# EAGLE design schematic (EAGLE 9.6.1)
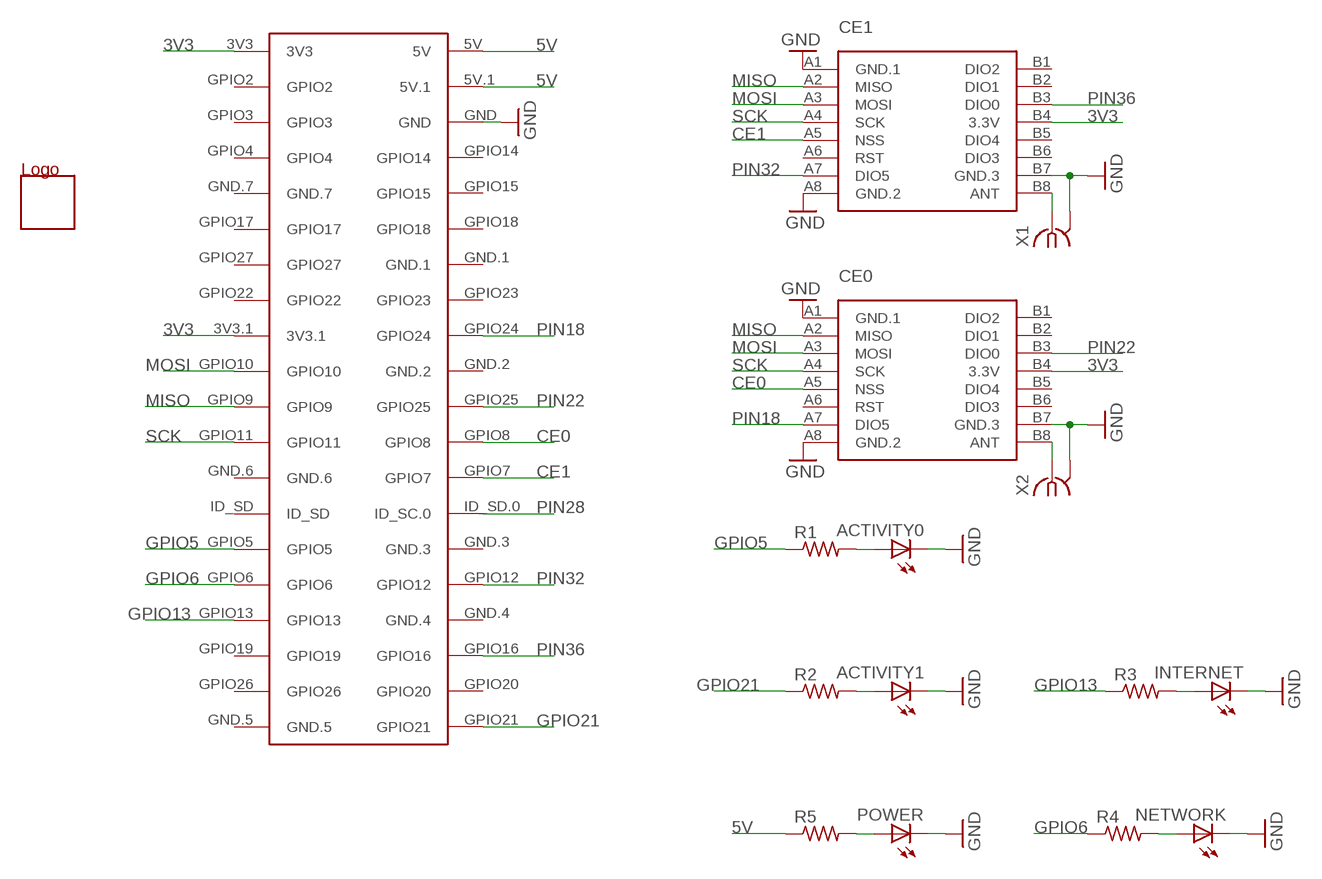
[diagram p0: schematic, sheet 1]

## Parts
ACTIVITY0  LEDCHIPLED_0805  [CHIPLED_0805]
ACTIVITY1  LEDCHIPLED_0805  [CHIPLED_0805]
CE0  WIRELESS-LORA-RFM95W#SMD  [WIRELESS-LORA-RFM95W#SMD]
CE1  WIRELESS-LORA-RFM95W#SMD  [WIRELESS-LORA-RFM95W#SMD]
INTERNET  LEDCHIPLED_0805  [CHIPLED_0805]
NETWORK  LEDCHIPLED_0805  [CHIPLED_0805]
POWER  LEDCHIPLED_0805  [CHIPLED_0805]
R1  R-US_R0805  [R0805]
R2  R-US_R0805  [R0805]
R3  R-US_R0805  [R0805]
R4  R-US_R0805  [R0805]
R5  R-US_R0805  [R0805]
U$1  PIZERO  [PIZERO]
U$2  REGANLOGO  [REGANLOGO]
X1  BU-SMA-V  [BU-SMA-V]
X2  BU-SMA-V  [BU-SMA-V]

## Nets
3V3: CE0.B4(3.3V) CE1.B4(3.3V) U$1.3V3 U$1.3V3.1
5V: R5.1 U$1.5V U$1.5V.1
CE0: CE0.A5(NSS) U$1.GPIO8
CE1: CE1.A5(NSS) U$1.GPIO7
GND: ACTIVITY0.C ACTIVITY1.C CE0.A1(GND.1) CE0.A8(GND.2) CE0.B7(GND.3) CE1.A1(GND.1) CE1.A8(GND.2) CE1.B7(GND.3) INTERNET.C NETWORK.C POWER.C U$1.GND X1.2 X1.3 X1.4 X1.5 X2.2 X2.3 X2.4 X2.5
GPIO5: R1.1 U$1.GPIO5
GPIO6: R4.1 U$1.GPIO6
GPIO13: R3.1 U$1.GPIO13
GPIO21: R2.1 U$1.GPIO21
MISO: CE0.A2(MISO) CE1.A2(MISO) U$1.GPIO9
MOSI: CE0.A3(MOSI) CE1.A3(MOSI) U$1.GPIO10
N$1: ACTIVITY0.A R1.2
N$2: ACTIVITY1.A R2.2
N$3: INTERNET.A R3.2
N$4: NETWORK.A R4.2
N$5: POWER.A R5.2
N$6: CE1.B8(ANT) X1.1
N$7: CE0.B8(ANT) X2.1
PIN18: CE0.A7(DIO5) U$1.GPIO24
PIN22: CE0.B3(DIO0) U$1.GPIO25
PIN28: U$1.ID_SD.0(ID_SC.0)
PIN32: CE1.A7(DIO5) U$1.GPIO12
PIN36: CE1.B3(DIO0) U$1.GPIO16
SCK: CE0.A4(SCK) CE1.A4(SCK) U$1.GPIO11
Unconnected: CE0.A6(RST) CE0.B1(DIO2) CE0.B2(DIO1) CE0.B5(DIO4) CE0.B6(DIO3) CE1.A6(RST) CE1.B1(DIO2) CE1.B2(DIO1) CE1.B5(DIO4) CE1.B6(DIO3) U$1.GND.1 U$1.GND.2 U$1.GND.3 U$1.GND.4 U$1.GND.5 U$1.GND.6 U$1.GND.7 U$1.GPIO2 U$1.GPIO3 U$1.GPIO4 U$1.GPIO14 U$1.GPIO15 U$1.GPIO17 U$1.GPIO18 U$1.GPIO19 U$1.GPIO20 U$1.GPIO22 U$1.GPIO23 U$1.GPIO26 U$1.GPIO27 U$1.ID_SD

## Library data of the parts
ACTIVITY0 ACTIVITY1 INTERNET NETWORK POWER = adafruit:LED: LED OSRAM: - CHIPLED LG R971, LG N971, LY N971, LG Q971, LY Q971, LO R971, LY R971 LH N974, LH R974 LS Q976, LO Q976, LY Q976 LO Q996 - Hyper CHIPLED LW Q18S LB Q993, LB Q99A, LB R99A - SideLED LS A670, LO A670, LY A670, LG A670, LP A670 LB A673, LV A673, LT A673, LW A673 LH A674 LY A675 LS A676, LA A676, LO A676, LY A676, LW A676 LS A679, LY A679, LG A679 - Hyper Micro SIDELED® LS Y876, LA Y876, LO Y876, LY Y876 LT Y87S - SmartLED LW L88C, LW L88S LB L89C, LB L89S, LG L890 LS L89K, LO L89K, LY L89K LS L896, LA L896, LO L896, LY L896 - TOPLED LS T670, LO T670, LY T670, LG T670, LP T670 LSG T670, LSP T670, LSY T670, LOP T670, LYG T670 LG T671, LOG T671, LSG T671 LB T673, LV T673, LT T673, LW T673 LH T674 LS T676, LA T676, LO T676, LY T676, LB T676, LH T676, LSB T676, LW T676 LB T67C, LV T67C, LT T67C, LS T67K, LO T67K, LY T67K, LW E67C LS E67B, LA E67B, LO E67B, LY E67B, LB E67C, LV E67C, LT E67C LW T67C LS T679, LY T679, LG T679 LS T770, LO T770, LY T770, LG T770, LP T770 LB T773, LV T773, LT T773, LW T773 LH T774 LS E675, LA E675, LY E675, LS T675 LS T776, LA T776, LO T776, LY T776, LB T776 LHGB T686 LT T68C, LB T68C - Hyper Mini TOPLED® LB M676 - Mini TOPLED Santana® LG M470 LS M47K, LO M47K, LY M47K Source: http://www.osram.convergy.de/
CE0 CE1 = diy-modules:WIRELESS-LORA-RFM95W: 868/915 MHz LoRa Radio Transceiver Module based on SX1276 chip Click here to find device on ebay.com <http://www.ebay.com/sch/RFM95W+transceiver>
R1-R5 = rcl:R-US_: RESISTOR, American symbol; SPICEPREFIX: R
U$1 = MyLib:PIZERO
U$2 = MyLib:REGANLOGO
X1 X2 = con-coax:BU-SMA-V: FEMALE SMA CONNECTOR Radiall distributor RS 112-3794; OC_FARNELL: unknown; OC_NEWARK: unknown

## Board
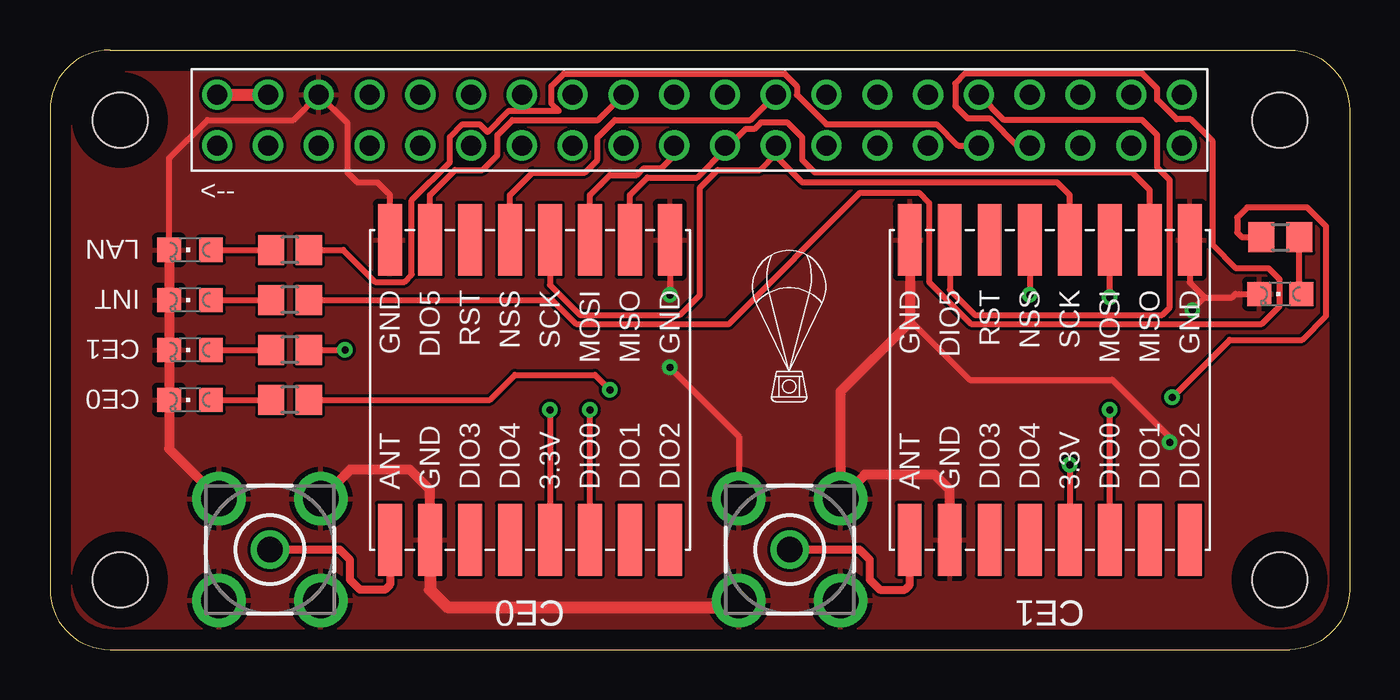
[diagram p1: board, top side]
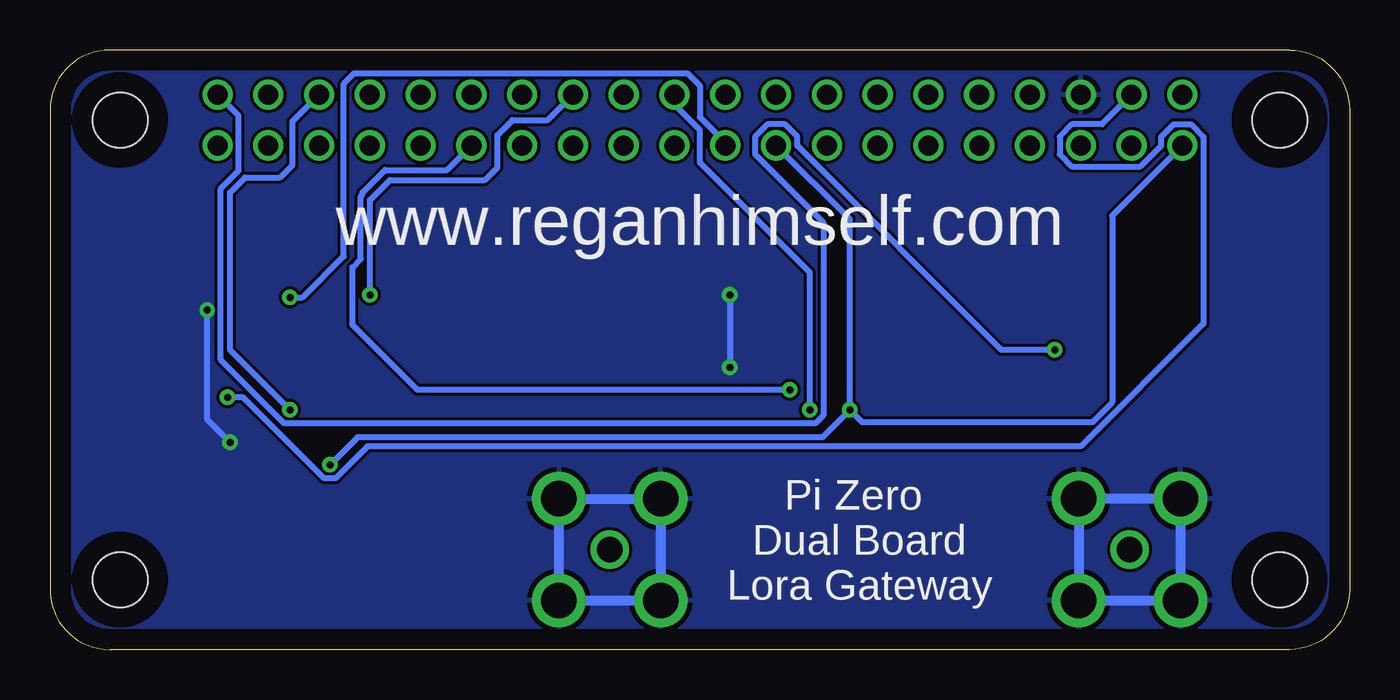
[diagram p2: board, bottom side, seen from below]

Size 65 x 30 mm. Coordinates in mm from the lower left corner, seen from the top.
Outline: 3,30 62,30 arc-90 65,27 65,3 arc-90 62,0 3,0 arc-90 0,3 0,27 arc-90 3,30
Copper layers (1*16): Top 0.035mm / dielectric 1.5mm / Bottom 0.035mm
Design rules "default": minimum track width 6mil, minimum drill 0.35mm, track to track 6mil, track to pad 6mil, pad to pad 6mil, via to via 6mil, smd to smd 6mil, copper to edge 40mil, drill to drill 6mil, minimum pad ring 10mil, minimum via ring 8mil, stop-mask expansion 4mil, vias tented up to drill 0mil, thermal gap 10mil
Holes 2.75 mm at 3.5,26.5 61.5,26.5 61.5,3.5 3.5,3.5

### Footprints (pad centres in the part's own frame; a part is rotated, then mirrored left to right if it is on the bottom)
CHIPLED_0805 = smd 1.2 x 1.2: A 0,-1.05; C 0,1.05
WIRELESS-LORA-RFM95W#SMD = smd 3.6 x 1.2: A1 -7.5,7; A2 -7.5,5; A3 -7.5,3; A4 -7.5,1; A5 -7.5,-1; A6 -7.5,-3; A7 -7.5,-5; A8 -7.5,-7; B1 7.5,7; B2 7.5,5; B3 7.5,3; B4 7.5,1; B5 7.5,-1; B6 7.5,-3; B7 7.5,-5; B8 7.5,-7
R0805 = smd 1.3 x 1.5: 1 -0.95,0; 2 0.95,0
PIZERO = drill 1: 3V3 0,0; 3V3.1 0,-20.32; 5V 2.54,0; 5V.1 2.54,-2.54; GND 2.54,-5.08; GND.1 2.54,-15.24; GND.2 2.54,-22.86; GND.3 2.54,-35.56; GND.4 2.54,-40.64; GND.5 0,-48.26; GND.6 0,-30.48; GND.7 0,-10.16; GPIO2 0,-2.54; GPIO3 0,-5.08; GPIO4 0,-7.62; GPIO5 0,-35.56; GPIO6 0,-38.1; GPIO7 2.54,-30.48; GPIO8 2.54,-27.94; GPIO9 0,-25.4; GPIO10 0,-22.86; GPIO11 0,-27.94; GPIO12 2.54,-38.1; GPIO13 0,-40.64; GPIO14 2.54,-7.62; GPIO15 2.54,-10.16; GPIO16 2.54,-43.18; GPIO17 0,-12.7; GPIO18 2.54,-12.7; GPIO19 0,-43.18; GPIO20 2.54,-45.72; GPIO21 2.54,-48.26; GPIO22 0,-17.78; GPIO23 2.54,-17.78; GPIO24 2.54,-20.32; GPIO25 2.54,-25.4; GPIO26 0,-45.72; GPIO27 0,-15.24; ID_SD 0,-33.02; ID_SD.0 2.54,-33.02
BU-SMA-V = drill 1.27: 1 0,0 | drill 1.778: 2 -2.55,2.55; 3 2.55,2.55; 4 2.55,-2.55; 5 -2.55,-2.55

### Placement (x,y rotation side)
ACTIVITY0  7,12.5 90 top
ACTIVITY1  7,15 90 top
CE0  24,13 270 top
CE1  50,13 270 top
INTERNET  7,17.5 90 top
NETWORK  7,20 90 top
POWER  61.53,17.79 90 top
R1  12,12.5 180 top
R2  12,15 180 top
R3  12,17.5 180 top
R4  12,20 180 top
R5  61.54,20.63 0 top
U$1  8.36,25.22 90 top
U$2  30.88,3.12 0 top
X1  37,5 0 top
X2  11,5 90 top

### Tracks (layer width: path | path; a pad name or v marks a point on that pad's centre or on a via)
3V3  (via drill 0.35)
  Top 0.3: v25,12 CE0.B4 | v51,9.25 CE1.B4
  Bottom 0.3: v25,12 25,21.54 U$1.3V3.1 | v25,12 26.38,10.62 49.62,10.62 v51,9.25 | U$1.3V3 11.88,21.71 11.88,12.38 12.88,11.38 24.38,11.38 v25,12
5V  (via drill 0.35)
  Top 0.3: v56.12,12.62 59,15.5 62.62,15.5 63.83,16.7 63.83,21.17 62.88,22.12 59.88,22.12 59.38,21.62 59.38,20.88 59.62,20.63 R5.1
  Top 0.6: U$1.5V U$1.5V.1
  Bottom 0.3: U$1.5V.1 12.38,26.28 13.88,26.28 14.5,25.66 14.5,24.78 13.88,24.17 10.46,24.17 9.42,25.21 9.42,25.66 8.8,26.28 7.92,26.28 7.3,25.66 7.3,16.31 13.44,10.17 49.11,10.17 50.72,8.57 51.28,8.57 55.34,12.62 v56.12,12.62
CE0
  Top 0.3: CE0.A5 23,22.75 24.12,23.88 26.75,23.88 27.38,24.5 27.38,25.62 28.25,26.5 35.04,26.5 U$1.GPIO8
CE1  (via drill 0.35)
  Top 0.3: CE1.A5 v49,17.75
  Bottom 0.3: v49,17.75 49,22.5 48,23.5 43.25,23.5 42.62,24.12 42.62,25.75 41.88,26.5 40.1,26.5 U$1.GPIO7
GND  (via drill 0.35)
  Top 0.3: CE1.A1 57,18.38 57.75,17.62 | POWER.C 59.29,17.79 59.12,17.62 57.75,17.62 | CE0.A8 17,22.75 16.38,23.38 15.38,23.38 14.88,23.88 14.88,26.33 U$1.GND 12.18,26.5 7.88,26.5 5.95,24.58 NETWORK.C | CE0.A1 v31,17.75 | v31,14.12 34.45,10.67 X1.2 | 43,16.38 43.12,16.38 46,13.5 53.12,13.5 56,10.62 v56,10.38 | v57.13,16.98 57.13,17.01 57.75,17.62
  Top 0.5: NETWORK.C INTERNET.C ACTIVITY1.C ACTIVITY0.C 5.95,10.05 X2.3 | CE0.B7 19,8 18,9 15,9 X2.4 | CE1.B7 45,8 44.25,8.75 40.75,8.75 X1.3 39.55,12.92 43,16.38 CE1.A8
  Top 0.6: CE0.B7 19,3 19.88,2.12 34.12,2.12 X1.5
  Bottom 0.3: v31,17.75 v31,14.12 | v56,10.38 57.13,11.51 v57.13,16.98
  Bottom 0.5: X2.3 X2.4 X2.5 X2.2 X2.3 | X1.2 X1.5 X1.4 X1.3 X1.2
  pour Top: 61.88,17 60.88,16 60,16 59.12,16 59,15.88 59.12,15.75 61.88,15.75 62.38,15.75 63.5,16.88 63.5,17
  pour Top: 33.62,23.75 32.75,22.88 32.75,17.62 31.75,16.62 33.75,16.62 40.12,23 37.62,23 36.88,23.75
  pour Top: -4,31.5 -4,-3.5 68.5,-3.5 68.5,32 -4,32
  pour Bottom: -4,33.5 -4,-3.5 68.5,-3.5 68.5,32 68.5,33.5
GPIO5  (via drill 0.35)
  Top 0.3: R1.1 22,12.5 23.25,13.75 27.25,13.75 v28,13
  Bottom 0.3: v28,13 46.62,13 49.88,16.25 49.88,19.12 49.45,19.55 49.45,22.69 49.38,22.77 49.38,22.88 48.25,24 45.14,24 U$1.GPIO5
GPIO6
  Top 0.3: R4.1 14.67,20 16.27,18.4 17.73,18.4 18.1,18.77 18.1,22.49 20.01,24.39 20.01,25.66 20.62,26.28 21.5,26.28 21.88,25.9 22.94,26.95 25.46,26.95 25.09,27.32 25.09,28.2 25.7,28.82 36.74,28.82 37.36,28.2 37.36,27.75 38.83,26.28 44.36,26.28 45.42,25.22 U$1.GPIO6
GPIO13
  Top 0.3: R3.1 25.11,17.5 26.31,16.3 33.97,16.3 40.52,22.85 43.47,22.85 43.97,22.35 43.97,18.39 46.06,16.3 60.61,16.3 61.51,17.19 61.51,18.52 60.95,19.07 59.33,19.07 58.15,20.24 58.15,25.44 57.06,26.53 56.36,26.53 55.39,27.5 55.39,28.08 54.64,28.82 45.77,28.82 45.28,28.33 45.28,27.2 45.9,26.58 47,26.58 48.36,25.22 U$1.GPIO13
GPIO21  (via drill 0.35)
  Top 0.3: R2.1 v14.75,15
  Bottom 0.3: v14.75,15 17.41,15 27.62,25.21 27.62,25.66 28.24,26.28 29.12,26.28 29.74,25.66 29.74,24.78 26.32,21.37 26.32,11.72 26.72,11.32 53.28,11.32 56.45,14.49 56.45,23.06 55.56,23.95 55.56,26.71 U$1.GPIO21
MISO
  Top 0.3: CE0.A2 29,22.75 29.88,23.62 32.38,23.62 33.76,25.01 | 33.76,25.01 U$1.GPIO9 | CE1.A2 55,23 54.12,23.88 38.25,23.88 37.62,24.5 37.62,25.62 36.88,26.38 35.55,26.38 35.23,26.05 34.8,26.05 33.76,25.01
MOSI  (via drill 0.35)
  Top 0.3: CE0.A3 27,22.75 28,23.75 29.36,23.75 29.69,24.08 30.58,24.08 31.22,24.72 U$1.GPIO10 | v53,17.62 CE1.A3
  Bottom 0.3: U$1.GPIO10 31.22,25.36 32.5,26.64 32.5,28.2 33.12,28.83 49.8,28.83 50.31,28.31 50.31,19.69 52.38,17.62 v53,17.62
N$1
  Top 0.3: ACTIVITY0.A R1.2
N$2
  Top 0.3: ACTIVITY1.A R2.2
N$3
  Top 0.3: INTERNET.A R3.2
N$4
  Top 0.3: NETWORK.A R4.2
N$5
  Top 0.3: POWER.A 62.49,17.88 R5.2
N$6
  Top 0.4: X1.1 40.5,5 41,4.5 41,3.5 41.5,3 42.75,3 43,3.25 CE1.B8
N$7
  Top 0.4: CE0.B8 17,3.25 16.75,3 15.5,3 15,3.5 15,4.5 14.5,5 X2.1
PIN18
  Top 0.3: CE0.A7 19,22.75 20.25,24 21.62,24 22.38,24.75 22.38,25.75 23.12,26.5 27.42,26.5 U$1.GPIO24
PIN22  (via drill 0.35)
  Top 0.3: CE0.B3 v27,12
  Bottom 0.3: v27,12 27,18.88 32.5,24.38 32.5,26 33.76,27.26 U$1.GPIO25
PIN32
  Top 0.3: CE1.A7 45,18 46.25,16.75 55.62,16.75 56,17.12 56,23.5 55.38,24.12 55.38,25.75 54.62,26.5 47.72,26.5 U$1.GPIO12
PIN36  (via drill 0.35)
  Top 0.3: CE1.B3 v53,12
  Bottom 0.3: v53,12 56,15 56,22.88 55.25,23.62 53.5,23.62 52.88,24.25 52.88,26.43 U$1.GPIO16
SCK
  Top 0.3: CE0.A4 25,18.25 26.5,16.75 31.5,16.75 32.5,17.75 32.5,23.11 33.39,24 35.5,24 36.3,24.8 U$1.GPIO11 36.3,24.7 37.62,23.38 50.38,23.38 51,22.75 CE1.A4

### Text on the board
tNames: <-- | LAN | INT | CE1 | CE0
bNames: www.reganhimself.com | Pi Zero / Dual Board / Lora Gateway
_tNames: CE0 | CE1